# EAGLE design carret (EAGLE 5.11)
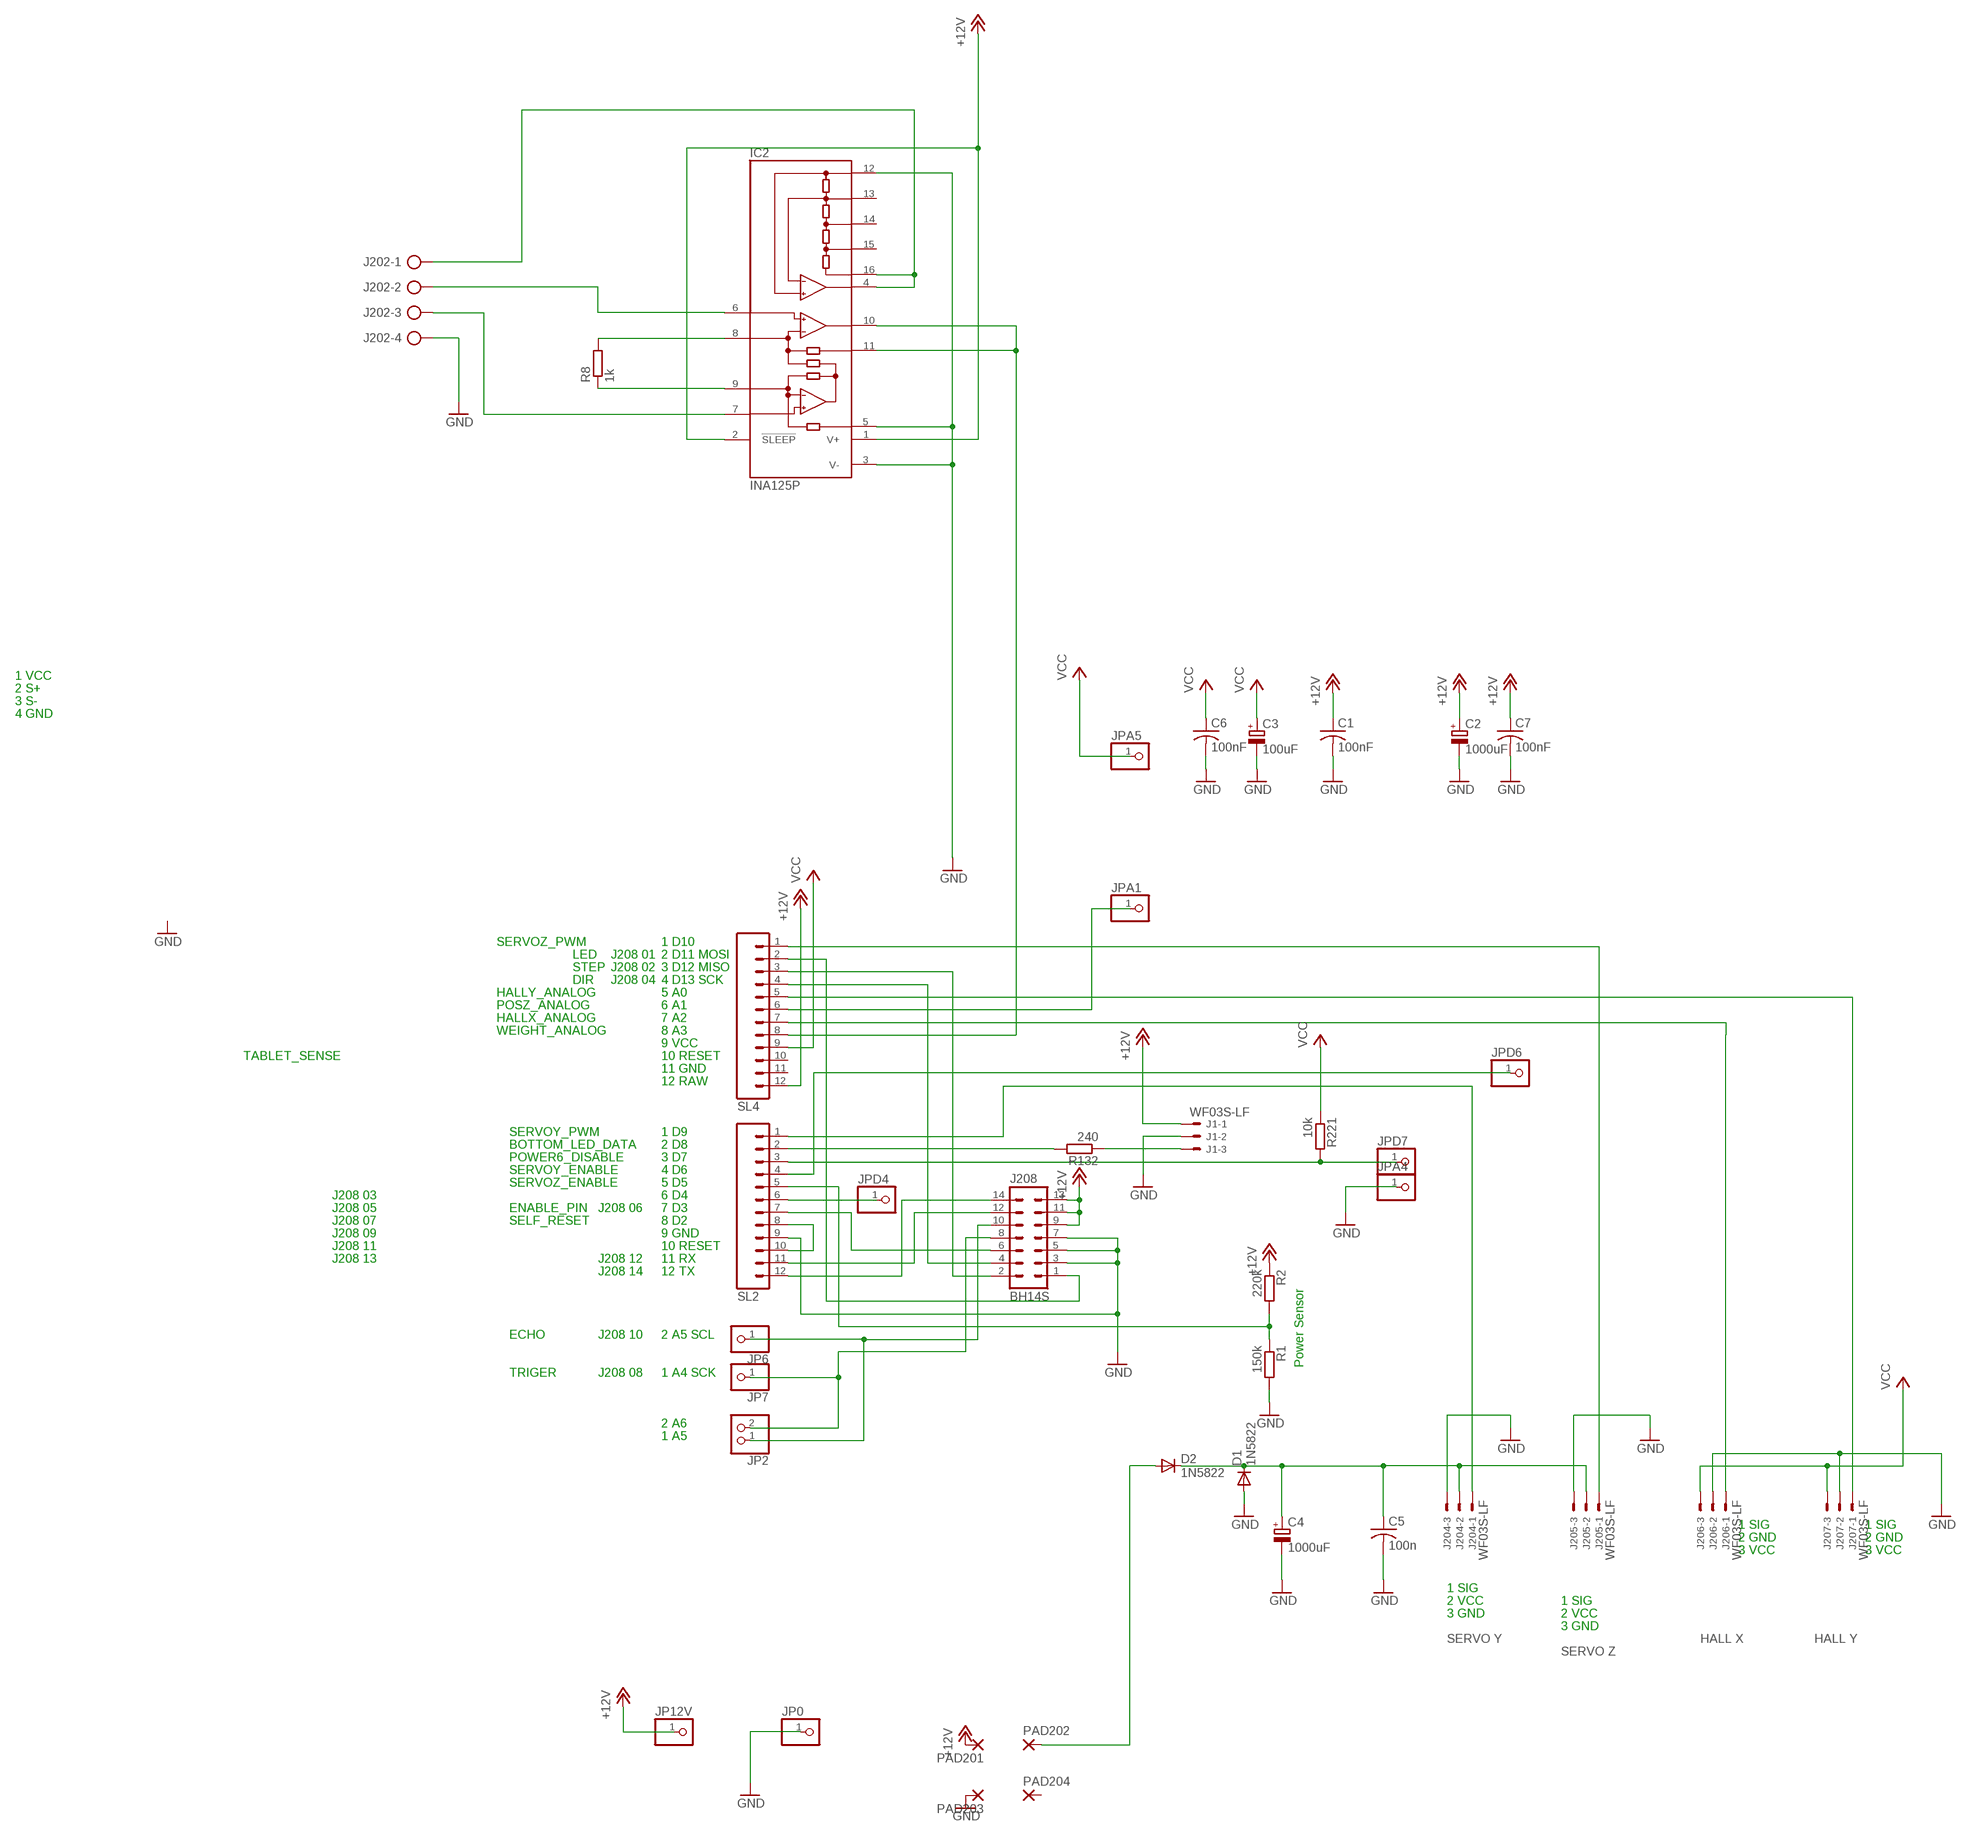
[diagram p0: schematic, sheet 1]

## Parts
C1  100nF  C-US050-030X075  [C050-030X075]
C2  1000uF  CPOL-EUE5-10.5  [E5-10,5]
C3  100uF  CPOL-EUE3.5-8  [E3,5-8]
C4  1000uF  CPOL-EUE5-10.5  [E5-10,5]
C5  100n  C-US050-030X075  [C050-030X075]
C6  100nF  C-US050-030X075  [C050-030X075]
C7  100nF  C-US050-030X075  [C050-030X075]
D1  1N5822  DIODE-DO27-15  [DO27-15]
D2  1N5822  DIODE-DO201-15  [DO201-15]
IC2  INA125P  [DIL16]
J1  WF03S-LF  22-27-2031-03  [6410-03]
J202  AK300/4  [AK300/4]
J204  WF03S-LF  22-27-2031-03  [6410-03]
J205  WF03S-LF  22-27-2031-03  [6410-03]
J206  WF03S-LF  22-27-2031-03  [6410-03]
J207  WF03S-LF  22-27-2031-03  [6410-03]
J208  BH14S  ML14  [ML14]
JP0  PINHD-1X1  [1X01]
JP2  PINHD-1X2  [1X02]
JP6  PINHD-1X1  [1X01]
JP7  PINHD-1X1  [1X01]
JP12V  PINHD-1X1  [1X01]
JPA1  PINHD-1X1  [1X01]
JPA4  PINHD-1X1  [1X01]
JPA5  PINHD-1X1  [1X01]
JPD4  PINHD-1X1  [1X01]
JPD6  PINHD-1X1  [1X01]
JPD7  PINHD-1X1  [1X01]
PAD201  3,81/1,1  [3,81/1,1]
PAD202  3,81/1,1  [3,81/1,1]
PAD203  3,81/1,1  [3,81/1,1]
PAD204  3,81/1,1  [3,81/1,1]
R1  150k  R-EU_0207/10  [0207/10]
R2  220k  R-EU_0207/10  [0207/10]
R8  1k  R-EU_0207/10  [0207/10]
R132  240  R-EU_0207/10  [0207/10]
R221  10k  R-EU_0207/10  [0207/10]
SL2  M12  [12P]
SL4  M12  [12P]

## Nets
+12V [power12]: C1.1 C2.+ C7.1 IC2.1(V+) IC2.2(!SLEEP) J1.1 J208.9 J208.11 J208.13 JP12V.1 PAD201.1(P) R2.1 SL4.12
GND [ground]: C1.2 C2.- C3.- C4.- C5.2 C6.2 C7.2 D1.A IC2.3(V-) IC2.5(REF) IC2.12(REFCOM) J1.2 J202.4 J204.3 J205.3 J206.2 J207.2 J208.3 J208.5 J208.7 JP0.1 JPA4.1 PAD203.1(P) R1.2 SL2.9
N$1: J1.3 R132.1
N$2: J208.14 SL2.12
N$3: R132.2 SL2.2
N$4: JPD7.1 R221.2 SL2.3
N$5: J206.1 SL4.7
N$6: J208.1 SL4.2
N$7: J208.12 SL2.11
N$8: J208.2 SL4.3
N$9: J208.10 JP2.1 JP6.1
N$10: J205.1 SL4.1
N$11: J208.8 JP2.2 JP7.1
N$12: J208.4 SL4.4
N$13: IC2.6(+IN) J202.2
N$14 [power12]: D2.A PAD202.1(P)
N$15: SL2.8 SL2.10
N$16: J207.1 SL4.5
N$18: JPD6.1 SL2.4
N$19: R1.1 R2.2 SL2.5
N$21: J204.1 SL2.1
N$22 [power6]: C4.+ C5.1 D1.C D2.C J204.2 J205.2
N$24: JPD4.1 SL2.6
N$25: IC2.4(REFOUT) IC2.16(REF10) J202.1
N$26: IC2.7(-IN) J202.3
N$27: J208.6 SL2.7
N$28: JPA1.1 SL4.6
N$30: IC2.8(RG) R8.2
N$31: IC2.9(RG) R8.1
N$41: IC2.10(OUT) IC2.11(SENSE) SL4.8
VCC [power5]: C3.+ C6.1 J206.3 J207.3 JPA5.1 R221.1 SL4.9
Unconnected: IC2.13(REFBG) IC2.14(REF2.5) IC2.15(REF5) PAD204.1(P) SL4.10 SL4.11

## Notes on the sheet
- 1 VCC
- 2 S+
- 3 S-
- 4 GND
- SERVOZ_PWM | 1 D10
- LED | J208 01 | 2 D11 MOSI
- STEP | J208 02 | 3 D12 MISO
- DIR | J208 04 | 4 D13 SCK
- HALLY_ANALOG | 5 A0
- POSZ_ANALOG | 6 A1
- HALLX_ANALOG | 7 A2
- WEIGHT_ANALOG | 8 A3
- 9 VCC
- TABLET_SENSE | 10 RESET
- 11 GND
- 12 RAW
- SERVOY_PWM | 1 D9
- BOTTOM_LED_DATA | 2 D8
- POWER6_DISABLE | 3 D7
- SERVOY_ENABLE | 4 D6
- SERVOZ_ENABLE | 5 D5
- J208 03 | 6 D4
- J208 05 | ENABLE_PIN | J208 06 | 7 D3
- J208 07 | SELF_RESET | 8 D2
- J208 09 | 9 GND
- J208 11 | 10 RESET
- J208 13 | J208 12 | 11 RX
- J208 14 | 12 TX
- Power Sensor
- ECHO | J208 10 | 2 A5 SCL
- TRIGER | J208 08 | 1 A4 SCK
- 2 A6
- 1 A5
- 1 SIG | 1 SIG
- 2 GND | 2 GND
- 3 VCC | 3 VCC
- 1 SIG
- 2 VCC | 1 SIG
- 3 GND | 2 VCC
- 3 GND
- SERVO Y | HALL X | HALL Y
- SERVO Z

## Library data of the parts
C1 C5-C7 = resistor:C-US: CAPACITOR, American symbol
C2-C4 = rcl:CPOL-EU: POLARIZED CAPACITOR, European symbol
D1 D2 = diode:DIODE-: DIODE
IC2 = burr-brown:INA125: Instrumentation Amplifier with Precision Voltage Reference; MF: TEXAS INSTRUMENT CONNECTORS; MPN: INA125P; OC_FARNELL: 1459461; OC_NEWARK: 35C1726
J1 J204-J207 = con-molex:22-?-03: CONNECTOR wire to board 2.54 mm (.1 inch) pitch header; OC_FARNELL: unknown; OC_NEWARK: unknown
J202 = con-ptr500:AK300/4: CONNECTOR; OC_FARNELL: unknown; OC_NEWARK: unknown
J208 = con-ml:ML14: HARTING; OC_FARNELL: unknown; OC_NEWARK: unknown
JP0 JP6 JP7 JP12V JPA1 JPA4 JPA5 JPD4 JPD6 JPD7 = pinhead:PINHD-1X1: PIN HEADER
JP2 = pinhead:PINHD-1X2: PIN HEADER
PAD201-PAD204 = wirepad:3,81/1,1: THROUGH-HOLE PAD
R1 R2 R8 R132 R221 = rcl:R-EU_: RESISTOR, European symbol
SL2 SL4 = con-amp-quick:M12: AMP QUICK CONNECTOR; OC_FARNELL: unknown; OC_NEWARK: unknown

## Net classes
0 default: width 0.381 mm, drill 0.254 mm, clearance 0.254 mm
1 power12: width 1.778 mm
2 ground: width 0.508 mm
3 power5: width 0.508 mm
4 power6: width 1.778 mm

## Board
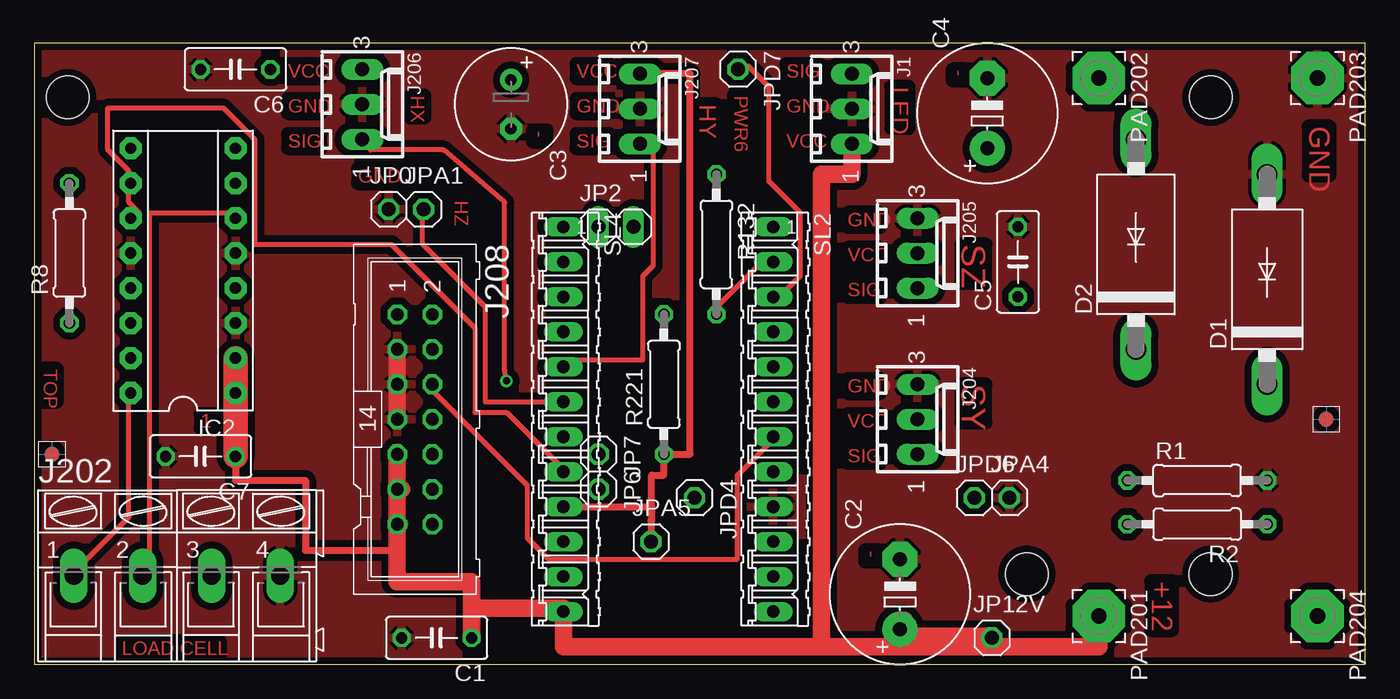
[diagram p1: board, top side]
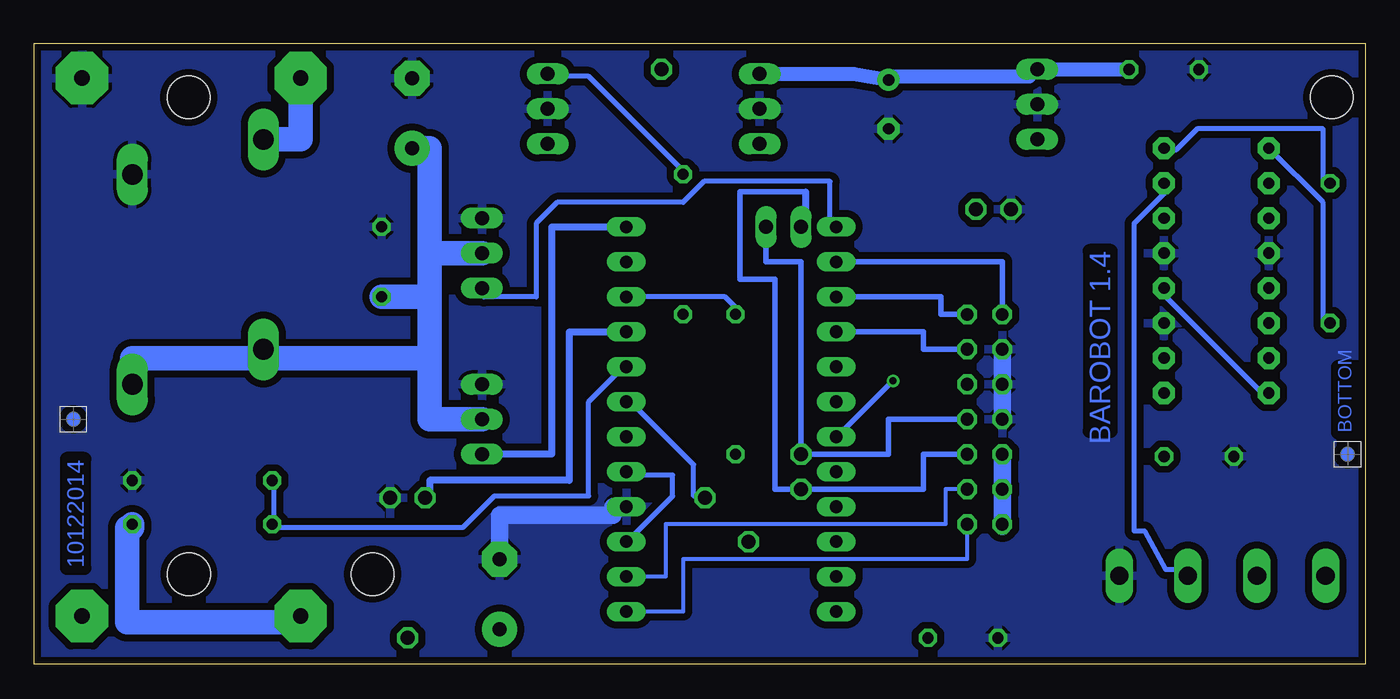
[diagram p2: board, bottom side, seen from below]

Size 96.65 x 45.09 mm. Coordinates in mm from the lower left corner, seen from the top.
Outline: 0,0 96.65,0 96.65,45.09 0,45.09 0,0
Copper layers (1*16): Top 0.035mm / dielectric 1.5mm / Bottom 0.035mm
Design rules "default *": minimum track width 10mil, minimum drill 0.5mm, track to track 10mil, track to pad 10mil, pad to pad 8mil, via to via 10mil, smd to smd 8mil, copper to edge 20mil, drill to drill 8mil, minimum pad ring 10mil, minimum via ring 8mil, stop-mask expansion 0mil, vias tented up to drill 0mil, thermal gap 10mil
Holes 3.1 mm at 85.42,6.54 85.44,41.15 2.41,41.15 72.09,6.54
bRestrict: area 122.7,23.5 to 124.3,26.4

### Footprints (pad centres in the part's own frame; a part is rotated, then mirrored left to right if it is on the bottom)
C050-030X075 = drill 0.813 octagon: 1 -2.54,0; 2 2.54,0
E5-10,5 = drill 1.016 pad 2.54 round: + -2.54,0 | drill 1.016 pad 2.54 octagon: - 2.54,0
E3,5-8 = drill 0.813 pad 1.6 round: + -1.778,0 | drill 0.813 pad 1.6 octagon: - 1.778,0
DO27-15 = drill 1.499 long: A 7.62,0; C -7.62,0
DO201-15 = drill 1.499 long: A 7.62,0; C -7.62,0
DIL16 = drill 0.813 pad 1.6 octagon: 1 -8.89,-3.81; 2 -6.35,-3.81; 3 -3.81,-3.81; 4 -1.27,-3.81; 5 1.27,-3.81; 6 3.81,-3.81; 7 6.35,-3.81; 8 8.89,-3.81; 9 8.89,3.81; 10 6.35,3.81; 11 3.81,3.81; 12 1.27,3.81; 13 -1.27,3.81; 14 -3.81,3.81; 15 -6.35,3.81; 16 -8.89,3.81
6410-03 = drill 1.016 long: 1 2.54,0; 2 0,0; 3 -2.54,0
AK300/4 = drill 1.321 long: 1 -7.493,0; 2 -2.515,0; 3 2.515,0; 4 7.493,0
ML14 = drill 0.914 octagon: 1 -7.62,-1.27; 2 -7.62,1.27; 3 -5.08,-1.27; 4 -5.08,1.27; 5 -2.54,-1.27; 6 -2.54,1.27; 7 0,-1.27; 8 0,1.27; 9 2.54,-1.27; 10 2.54,1.27; 11 5.08,-1.27; 12 5.08,1.27; 13 7.62,-1.27; 14 7.62,1.27
1X01 = drill 1.016 octagon: 1 0,0
1X02 = drill 1.016 long: 1 -1.27,0; 2 1.27,0
3,81/1,1 = drill 1.118 pad 3.81 octagon: 1 0,0
0207/10 = drill 0.813 octagon: 1 -5.08,0; 2 5.08,0
12P = drill 0.914 long: 1 -13.97,0; 2 -11.43,0; 3 -8.89,0; 4 -6.35,0; 5 -3.81,0; 6 -1.27,0; 7 1.27,0; 8 3.81,0; 9 6.35,0; 10 8.89,0; 11 11.43,0; 12 13.97,0

### Placement (x,y rotation side)
C1  29.21,1.91 180 top
C2  62.87,5.08 90 top
C3  34.61,40.64 270 top
C4  69.22,40.01 90 top
C5  71.44,29.21 90 top
C6  14.61,43.18 180 top
C7  12.06,15.08 180 top
D1  89.53,27.94 90 top
D2  80.01,30.48 90 top
IC2  10.79,28.57 90 top
J1  59.37,40.32 270 top
J202  10.37,6.42 0 top
J204  64.13,17.78 270 top
J205  64.13,29.84 270 top
J206  23.81,40.64 270 top
J207  43.97,40.32 270 top
J208  27.62,17.78 270 top
JP0  25.72,33.02 0 top
JP2  42.23,31.75 0 top
JP6  40.96,12.7 270 top
JP7  40.96,15.24 270 top
JP12V  69.53,1.91 0 top
JPA1  28.26,33.02 0 top
JPA4  70.8,12.06 0 top
JPA5  44.77,8.89 0 top
JPD4  47.94,12.06 270 top
JPD6  68.26,12.06 0 top
JPD7  51.12,43.18 270 top
PAD201  77.31,3.49 270 top
PAD202  77.31,42.55 270 top
PAD203  93.19,42.55 270 top
PAD204  93.19,3.49 270 top
R1  84.45,13.34 0 top
R2  84.45,10.16 180 top
R8  2.54,29.84 90 top
R132  49.53,30.48 270 top
R221  45.72,20.32 90 top
SL2  53.66,17.78 270 top
SL4  38.42,17.78 270 top
U$1  [FIDUCIAL_G10S]  1.27,15.24 0 top
U$2  [FIDUCIAL_G10S]  93.82,17.78 0 top
U$3  [FIDUCIAL_G10S]  93.82,17.78 0 bottom
U$4  [FIDUCIAL_G10S]  1.27,15.24 0 bottom

### Tracks (layer width: path | path; a pad name or v marks a point on that pad's centre or on a via)
+12V
  Top 0.508: 26.35,8.26 19.68,8.26 19.68,13.34 14.61,13.34 C7.1
  Top 1.27: 26.48,12.57 26.35,12.57 J208.11 26.67,12.7 | J208.13 26.48,10.16 | PAD201.1 77.31,1.27 62.8,1.27 | 26.35,15.37 J208.9 26.35,14.86 | 63.18,3.17 62.8,3.17 62.8,2.03 62.8,1.27 | JP12V.1 69.53,2.03 62.87,2.03 | 57.15,1.27 38.42,1.27 SL4.12 38.42,4.06 31.75,4.06 | 57.15,1.27 62.8,1.27 | 57.15,1.27 57.15,35.56 59.37,35.56 J1.1 | 31.75,4.06 31.75,5.97 26.35,5.97 26.35,8.26 26.35,14.86 | 26.35,14.86 | 31.75,4.06 C1.1
  Top 1.778: IC2.2 IC2.1 C7.1 | 62.8,2.03 62.87,2.03 C2.+
  Bottom 1.016: J208.11 | J208.9
  Bottom 1.27: 26.35,10.03 J208.13 26.35,10 | 77.18,3.11 77.18,3.49 PAD201.1 | 26.35,10 | J208.9 J208.11 26.35,10
  Bottom 1.778: R2.1 89.53,9.91 89.92,9.91 89.92,3.05 77.72,3.05 77.72,3.49 PAD201.1
GND
  Top 1.27: J208.7 J208.3
  Bottom 1.27: J208.7 J208.5 J208.3 | 63.18,6.99 62.87,6.99 62.87,10.79 54.61,10.79 54.61,11.43 SL2.9
  pour Top (isolate 0.508, rank 3): 0,45.09 96.52,45.09 96.52,0 0,0
  pour Bottom (isolate 0.508): 0,45.09 96.52,45.09 96.65,0 0,0
N$1
  Bottom 0.381: R132.1 49.53,35.81 56.39,42.67 58.67,42.67 J1.3
N$2
  Bottom 0.305: J208.14 | J208.14 28.89,7.62 49.53,7.62 49.53,3.81 SL2.12
N$3
  Top 0.381: R132.2 49.53,25.91 53.34,29.72 SL2.2
N$4
  Top 0.381: JPD7.1 51.82,43.43 53.34,41.91 53.34,35.05 55.63,32.77 55.63,28.19 54.1,26.67 SL2.3
  Bottom 0.381: R221.2 45.72,25.91 46.48,26.67 SL2.3
N$5  (via drill 0.5)
  Top 0.381: v34.29,20.57 34.16,21.34 34.16,33.53 29.72,37.34 24.38,37.34 24.38,38.1 J206.1
  Bottom 0.381: v34.29,20.57 38.1,16.76 SL4.7
N$6
  Bottom 0.406: SL4.2 26.35,29.21 J208.1
N$7
  Bottom 0.305: J208.12 30.48,12.7 30.48,10.16 50.8,10.16 50.8,6.35 SL2.11
N$8
  Bottom 0.406: J208.2 30.8,25.4 30.8,26.67 SL4.3
N$9
  Bottom 0.406: J208.10 32.07,15.24 32.07,12.7 JP6.1 42.86,12.7 42.86,27.94 45.4,27.94 45.4,34.29 40.64,34.29
  Bottom 0.508: JP2.1 40.64,31.75 40.64,34.29
N$10
  Bottom 0.381: SL4.1 38.86,32 38.86,35.05 48.01,35.05 49.53,33.53 58.67,33.53 60.2,32 60.2,26.67 64.01,26.67 J205.1
N$11
  Bottom 0.406: J208.8 34.61,17.78 34.61,15.24 JP7.1 40.96,29.21 43.5,29.21 JP2.2
N$12
  Bottom 0.406: J208.4 32.07,22.86 32.07,24.13 SL4.4
N$13
  Top 0.381: IC2.6 14.48,32.77 8.38,32.77 8.38,6.86 J202.2
N$14
  Top 1.27: PAD202.1 76.83,42.55
  Bottom 1.778: D2.A 77.31,38.1 PAD202.1
  Bottom 2.54: 77.47,43.18 77.47,42.55 PAD202.1
N$15
  Bottom 0.381: SL2.10 53.34,9.14 50.29,12.19 50.29,13.72 53.34,13.72 SL2.8
N$16
  Top 0.381: SL4.5 38.86,22.1 44.2,22.1 44.2,28.19 44.96,28.96 44.96,37.34 44.2,38.1 J207.1
N$18
  Bottom 0.508: SL2.4 57.78,24.13 57.78,13.34 67.94,13.34 67.94,12.06 JPD6.1
N$19
  Bottom 0.381: R1.1 79.25,12.95 79.25,10.67 R2.2 79.25,9.91 65.53,9.91 63.25,12.19 56.39,12.19 56.39,19.05 54.1,21.34 SL2.5
N$21
  Bottom 0.508: J204.1 59.05,15.24 59.05,31.75 SL2.1
N$22
  Bottom 1.778: J204.2 67.94,17.78 67.94,22.23 | 67.94,29.84 J205.2 | 67.94,22.23 67.94,26.67 | 67.94,26.67 67.94,29.84 | 67.94,29.84 67.94,37.47 C4.+ | D1.C 89.53,22.23 80.01,22.23 | 67.94,22.23 80.01,22.23 | 80.01,22.23 D2.C | 67.94,26.67 C5.1
N$24
  Bottom 0.381: SL2.6 53.34,19.05 48.77,14.48 48.77,12.19 48.01,12.19 JPD4.1
N$25
  Top 0.381: J202.1 3.05,6.86 6.86,10.67 6.86,19.05 IC2.16
  Bottom 0.381: IC2.16 7.62,19.81 14.48,26.67 IC2.4
N$26
  Bottom 0.381: IC2.7 14.48,34.29 16.76,32 16.76,9.65 16,9.65 14.48,6.86 12.95,6.86 J202.3
N$27
  Top 0.381: J208.6 28.96,19.81 35.81,12.95 35.81,9.14 37.34,7.62 51.05,7.62 51.05,13.72 53.34,16 SL2.7
N$28
  Top 0.381: SL4.6 32.77,19.05 32.77,25.91 28.19,30.48 28.19,32.77 JPA1.1
N$30
  Bottom 0.381: R8.2 3.05,35.05 3.05,38.86 12.19,38.86 13.72,37.34 14.48,37.34 IC2.8
N$31
  Bottom 0.381: R8.1 3.05,25.15 3.05,33.53 IC2.9
N$41
  Top 0.381: SL4.8 38.1,14.48 34.29,18.29 32,18.29 32,24.38 25.91,30.48 16,30.48 16,38.1 13.72,40.39 5.33,40.39 5.33,37.34 6.86,35.81 6.86,35.05 IC2.10 6.86,34.29 6.86,33.53 7.62,32.77 IC2.11
VCC
  Top 0.508: 38.42,11.68 SL4.9 44.83,11.43 | 44.83,11.43 44.83,10.41 44.77,10.41 JPA5.1 | 44.83,11.43 44.83,13.72 45.72,13.72 R221.1 47.62,15.24 47.62,42.86 J207.3
  Bottom 0.508: 43.94,42.86 J207.3 43.97,42.55 | 34.61,42.67 C3.+ 34.29,42.42 34.29,42.67 | 24.38,42.67 24.38,43.43 23.81,43.43 J206.3
  Bottom 1.016: J207.3 37.15,42.86 C3.+ | J206.3 C6.1 | 34.29,42.67 24.38,42.67

### Text on the board
Top: VCC | VCC | SIG | - | LED | HX | HY | PWR6 | GND | GND | GND | - | GND | SIG | SIG | VCC | GND | HZ | GND | SZ | VCC | SIG | TOP | GND | SY | 1 | VCC | SIG | - | +12 | LOAD CELL
Bottom: BAROBOT 1.4 | BOTTOM | 10122014